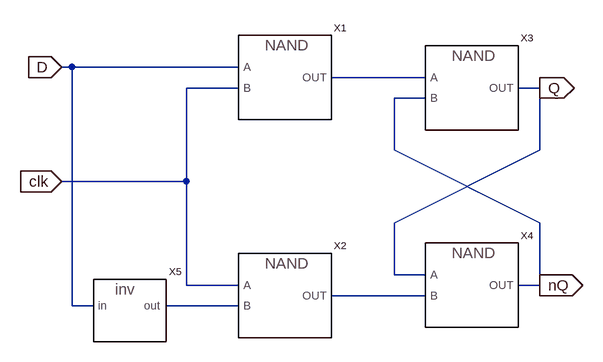
[diagram p0: schematic D_Latch.asc]
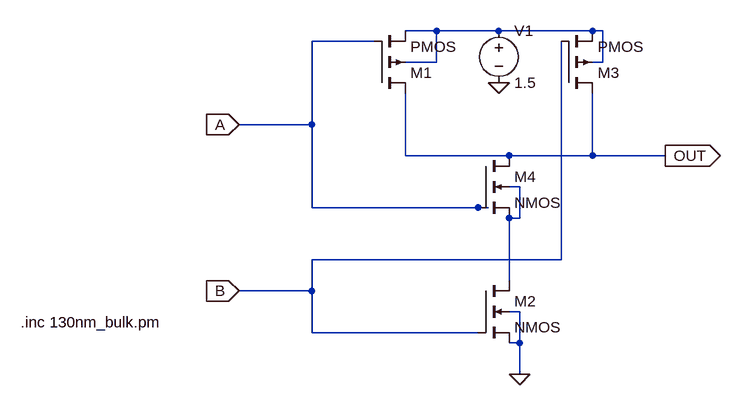
[diagram p1: sub-circuit nand.asc]
D_Latch.asc, the LTspice schematic file:
Version 4
SHEET 1 880 680
WIRE -208 144 -224 144
WIRE 48 144 -208 144
WIRE 336 160 192 160
WIRE 48 176 -32 176
WIRE 512 176 480 176
WIRE 336 192 288 192
WIRE 288 272 288 192
WIRE 512 272 512 176
WIRE -32 320 -32 176
WIRE -32 320 -224 320
WIRE 288 384 512 272
WIRE 512 384 288 272
WIRE 288 464 288 384
WIRE 336 464 288 464
WIRE -32 480 -32 320
WIRE 48 480 -32 480
WIRE 512 480 512 384
WIRE 512 480 480 480
WIRE 336 496 192 496
WIRE -208 512 -208 144
WIRE -176 512 -208 512
WIRE 48 512 -64 512
FLAG -224 320 clk
IOPIN -224 320 In
FLAG -224 144 D
IOPIN -224 144 In
FLAG 512 176 Q
IOPIN 512 176 Out
FLAG 512 480 nQ
IOPIN 512 480 Out
SYMBOL NAND 96 160 R0
SYMATTR InstName X1
SYMBOL NAND 96 496 R0
SYMATTR InstName X2
SYMBOL NAND 384 176 R0
SYMATTR InstName X3
SYMBOL NAND 384 480 R0
SYMATTR InstName X4
SYMBOL invert -128 528 R0
SYMATTR InstName X5

nand.asc, the sub-circuit schematic file:
Version 4
SHEET 1 880 680
WIRE 304 -256 256 -256
WIRE 400 -256 304 -256
WIRE 544 -256 400 -256
WIRE 560 -256 544 -256
WIRE 208 -240 112 -240
WIRE 304 -208 304 -256
WIRE 304 -208 256 -208
WIRE 560 -208 560 -256
WIRE 560 -208 544 -208
WIRE 112 -112 112 -240
WIRE 112 -112 0 -112
WIRE 256 -64 256 -160
WIRE 416 -64 256 -64
WIRE 544 -64 544 -160
WIRE 544 -64 416 -64
WIRE 656 -64 544 -64
WIRE 432 -16 416 -16
WIRE 112 16 112 -112
WIRE 368 16 112 16
WIRE 384 16 368 16
WIRE 432 32 432 -16
WIRE 432 32 416 32
WIRE 496 96 496 -240
WIRE 496 96 112 96
WIRE 416 128 416 32
WIRE 112 144 112 96
WIRE 112 144 0 144
WIRE 432 176 416 176
WIRE 112 208 112 144
WIRE 368 208 112 208
WIRE 432 224 432 176
WIRE 432 224 416 224
WIRE 432 272 432 224
FLAG 432 272 0
FLAG 400 -176 0
FLAG 656 -64 OUT
IOPIN 656 -64 Out
FLAG 0 -112 A
IOPIN 0 -112 In
FLAG 0 144 B
IOPIN 0 144 In
SYMBOL pmos4 208 -160 M180
SYMATTR InstName M1
SYMATTR Value2 l=130e-9 w=2600e-9 ad=676000e-18 as=676000e-18 pd=3640e-9 ps=3640e-9
SYMBOL nmos4 368 128 R0
SYMATTR InstName M2
SYMATTR Value2 l=130e-9 w=1300e-9 ad=676000e-18 as=676000e-18 pd=3640e-9 ps=3640e-9
SYMBOL pmos4 496 -160 M180
SYMATTR InstName M3
SYMATTR Value2 l=130e-9 w=2600e-9 ad=676000e-18 as=676000e-18 pd=3640e-9 ps=3640e-9
SYMBOL nmos4 368 -64 R0
SYMATTR InstName M4
SYMATTR Value2 l=130e-9 w=1300e-9 ad=676000e-18 as=676000e-18 pd=3640e-9 ps=3640e-9
SYMBOL voltage 400 -272 R0
WINDOW 123 0 0 Left 0
WINDOW 39 0 0 Left 0
SYMATTR InstName V1
SYMATTR Value 1.5
TEXT -336 192 Left 2 !.inc 130nm_bulk.pm

The netlist it stands for:
* D_Latch.asc
XX1 D clk N001 nand
XX2 clk N003 N002 nand
XX3 N001 nQ Q nand
XX4 Q N002 nQ nand
XX5 D N003 invert  ; pins in out

* block symbol definitions
.subckt nand A B OUT
M1 OUT A N001 N001 PMOS l=130e-9 w=2600e-9 ad=676000e-18 as=676000e-18 pd=3640e-9 ps=3640e-9
M2 N002 B 0 0 NMOS l=130e-9 w=1300e-9 ad=676000e-18 as=676000e-18 pd=3640e-9 ps=3640e-9
M3 OUT B N001 N001 PMOS l=130e-9 w=2600e-9 ad=676000e-18 as=676000e-18 pd=3640e-9 ps=3640e-9
M4 OUT A N002 N002 NMOS l=130e-9 w=1300e-9 ad=676000e-18 as=676000e-18 pd=3640e-9 ps=3640e-9
V1 N001 0 1.5
.inc 130nm_bulk.pm
.ends nand

.model NMOS NMOS
.model PMOS PMOS
.lib standard.mos
.backanno
.end